# Altium schematic sheet 11_Power.SchDoc: Power (part 1 of 3)
size A3; Organization: Lime Microsystems; Address1: Surrey Tech Centre; Address2: Guildford GU2 7YG; Address3: Surrey; Address4: United Kingdom; Revision: v1.2; SheetNumber: 11; SheetTotal: 11
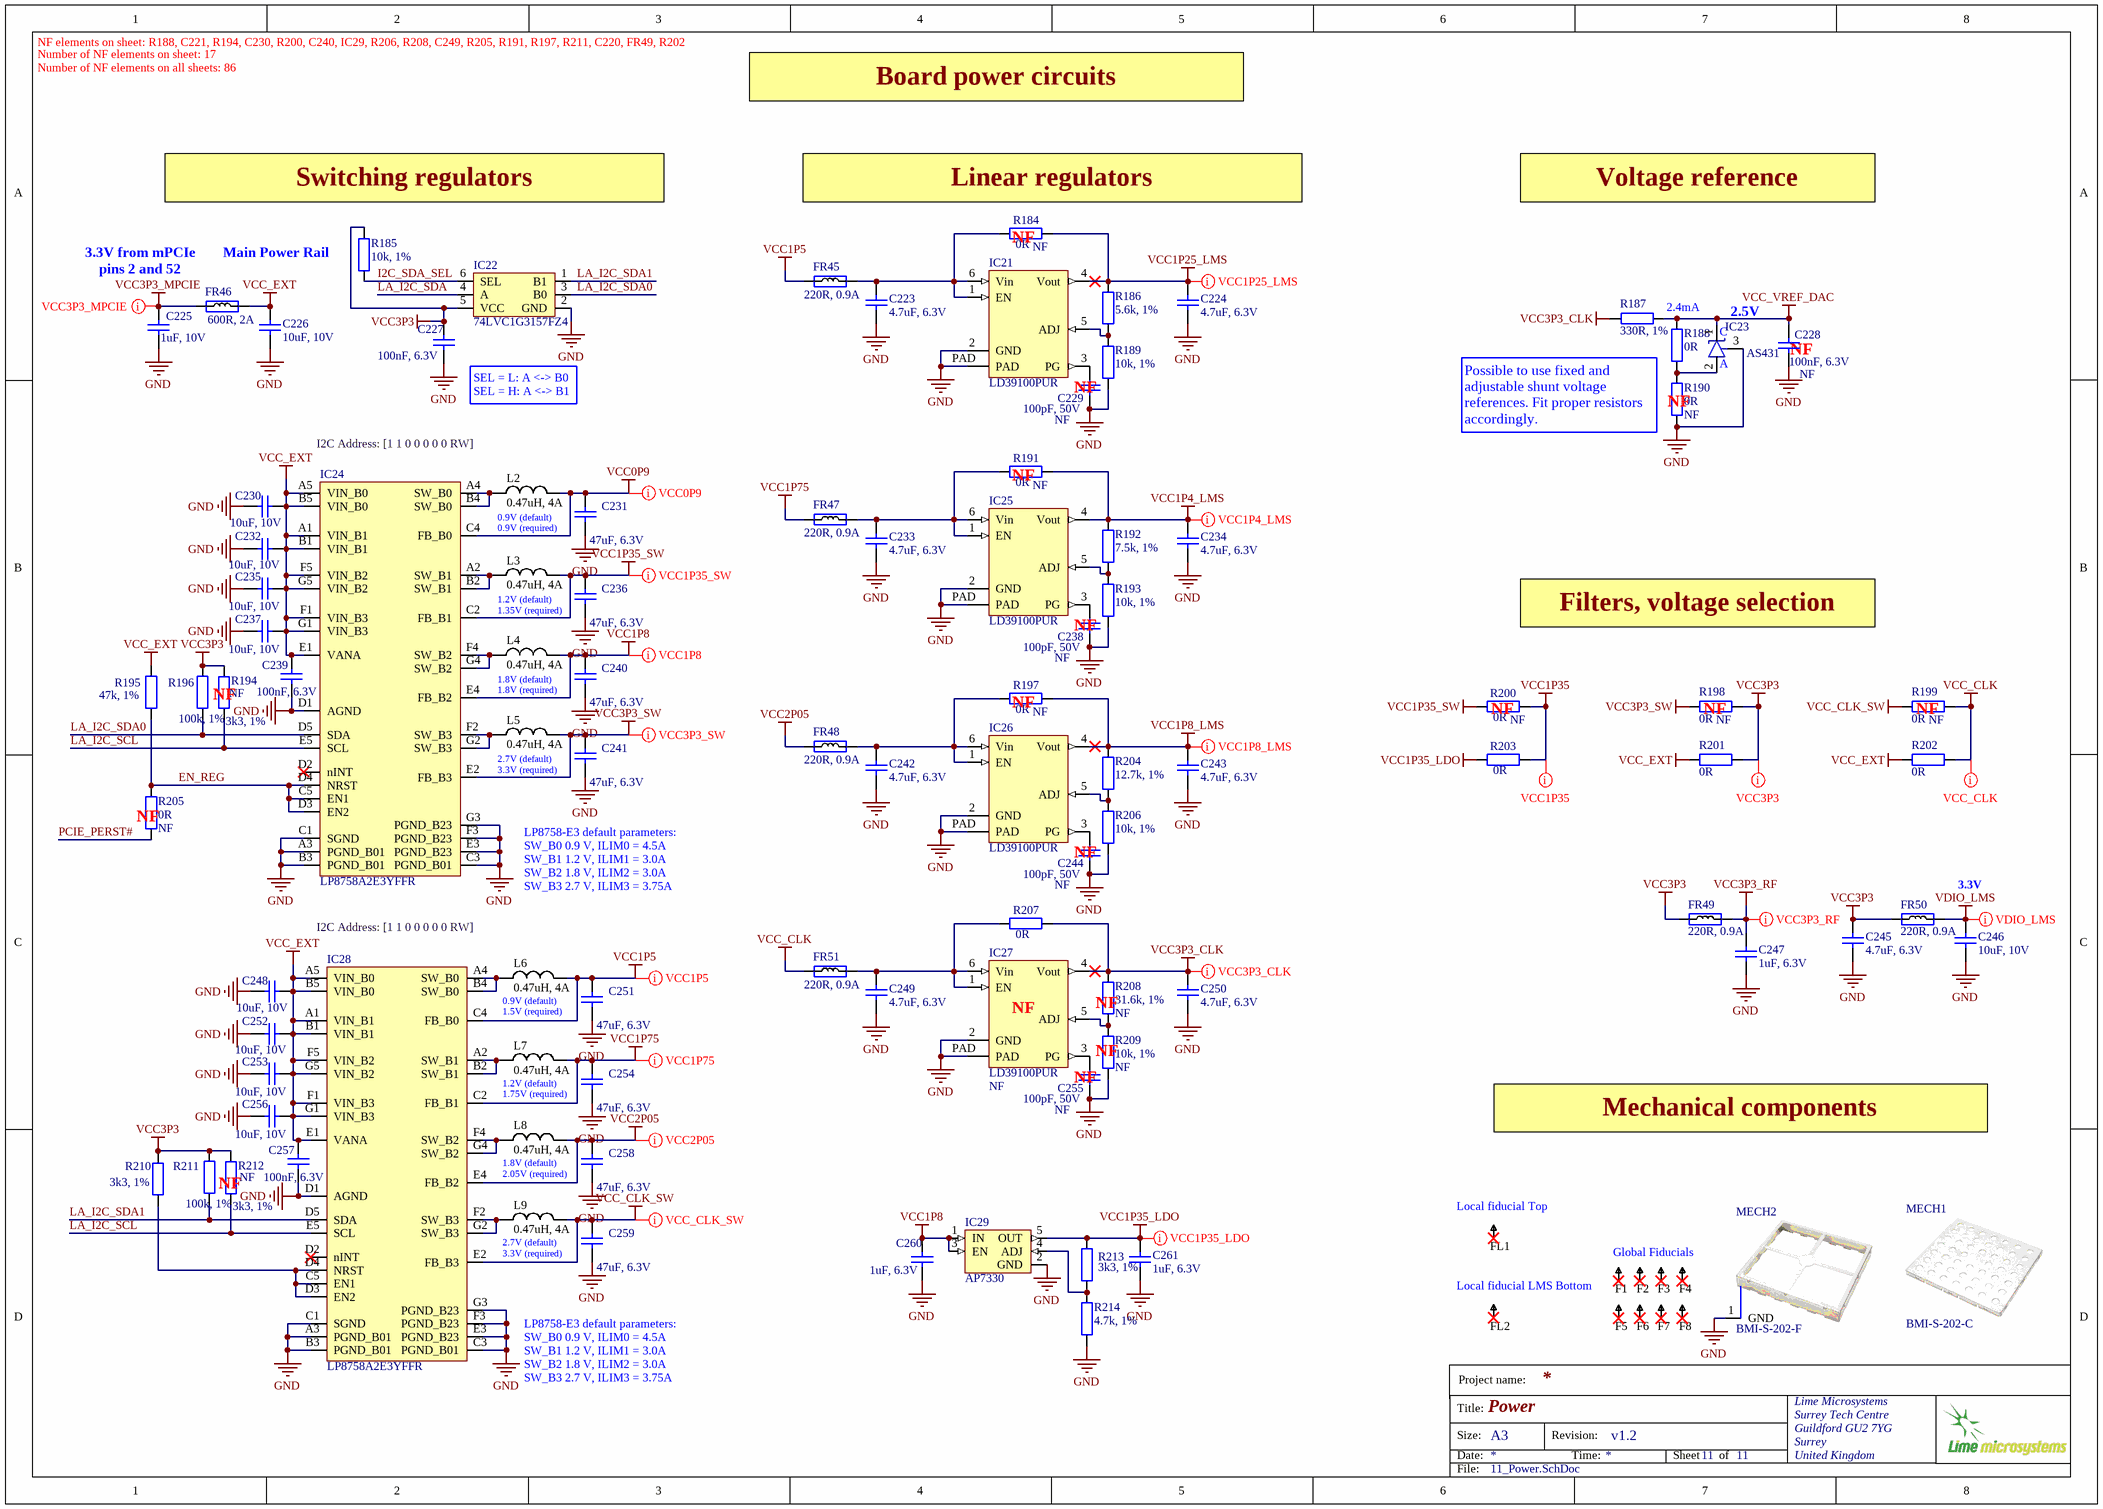
[diagram p0: 11_Power.SchDoc]

## Parts
C223  4.7uF, 6.3V  [CAP0402]
C224  4.7uF, 6.3V  [CAP0402]
C225  1uF, 10V  [CAP0402]
C226  10uF, 10V  [CAP0603]
C227  100nF, 6.3V  [CAP0201]
C228  100nF, 6.3V  Assembly Info: NF  [CAP0201]
C229  100pF, 50V  Assembly Info: NF  [CAP0201]
C230  10uF, 10V  [CAP0603]
C231  47uF, 6.3V  [CAP0603]
C232  10uF, 10V  [CAP0603]
C233  4.7uF, 6.3V  [CAP0402]
C234  4.7uF, 6.3V  [CAP0402]
C235  10uF, 10V  [CAP0603]
C236  47uF, 6.3V  [CAP0603]
C237  10uF, 10V  [CAP0603]
C238  100pF, 50V  Assembly Info: NF  [CAP0201]
C239  100nF, 6.3V  [CAP0201]
C240  47uF, 6.3V  [CAP0603]
C241  47uF, 6.3V  [CAP0603]
C242  4.7uF, 6.3V  [CAP0402]
C243  4.7uF, 6.3V  [CAP0402]
C244  100pF, 50V  Assembly Info: NF  [CAP0201]
C245  4.7uF, 6.3V  [CAP0402]
C246  10uF, 10V  [CAP0603]
C247  1uF, 6.3V  [CAP0201]
C248  10uF, 10V  [CAP0603]
C249  4.7uF, 6.3V  [CAP0402]
C250  4.7uF, 6.3V  [CAP0402]
C251  47uF, 6.3V  [CAP0603]
C252  10uF, 10V  [CAP0603]
C253  10uF, 10V  [CAP0603]
C254  47uF, 6.3V  [CAP0603]
C255  100pF, 50V  Assembly Info: NF  [CAP0201]
C256  10uF, 10V  [CAP0603]
C257  100nF, 6.3V  [CAP0201]
C258  47uF, 6.3V  [CAP0603]
C259  47uF, 6.3V  [CAP0603]
C260  1uF, 6.3V  [CAP0201]
C261  1uF, 6.3V  [CAP0201]
F1  Fiducial  [Fiducial]  (value not drawn)
F2  Fiducial  [Fiducial]  (value not drawn)
F3  Fiducial  [Fiducial]  (value not drawn)
F4  Fiducial  [Fiducial]  (value not drawn)
F5  Fiducial  [Fiducial]  (value not drawn)
F6  Fiducial  [Fiducial]  (value not drawn)
F7  Fiducial  [Fiducial]  (value not drawn)
F8  Fiducial  [Fiducial]  (value not drawn)
FL1  Fiducial  [Fiducial_local]  (value not drawn)
FL2  Fiducial  [Fiducial_local]  (value not drawn)
FR45  220R, 0.9A  [RES0402]
FR46  600R, 2A  [RES0805]
FR47  220R, 0.9A  [RES0402]
FR48  220R, 0.9A  [RES0402]
FR49  220R, 0.9A  [RES0402]
FR50  220R, 0.9A  [RES0402]
FR51  220R, 0.9A  [RES0402]
IC21  LD39100PUR  [LD39100PUR]
IC22  74LVC1G3157FZ4  [74LVC1G3157FZ4_SPDT_SW_DFN1410-6]
IC23  AS431  [SOT23-3_v3]
IC24  LP8758A2E3YFFR  [LP8758A1E0YFFR_QUAD_DC-DC_35DSBGA]
IC25  LD39100PUR  [LD39100PUR]
IC26  LD39100PUR  [LD39100PUR]
IC27  LD39100PUR  Assembly Info: NF  [LD39100PUR]
IC28  LP8758A2E3YFFR  [LP8758A1E0YFFR_QUAD_DC-DC_35DSBGA]
IC29  AP7330  [AP7330-W5-7_SOT25]
L2  0.47uH, 4A  [IND0806]
L3  0.47uH, 4A  [IND0806]
L4  0.47uH, 4A  [IND0806]
L5  0.47uH, 4A  [IND0806]
L6  0.47uH, 4A  [IND0806]
L7  0.47uH, 4A  [IND0806]
L8  0.47uH, 4A  [IND0806]
L9  0.47uH, 4A  [IND0806]
MECH1  BMI-S-202-C  [BMI-S-202-C_RF_SHIELD_COVER]
MECH2  BMI-S-202-F  [BMI-S-202-F_RF_SHIELD_FRAME_v3]
R184  0R  Assembly Info: NF  [RES0201]
R185  10k, 1%  [RES0201]
R186  5.6k, 1%  [RES0201]
R187  330R, 1%  [RES0201]
R188  0R  [RES0201]
R189  10k, 1%  [RES0201]
R190  0R  Assembly Info: NF  [RES0201]
R191  0R  Assembly Info: NF  [RES0201]
R192  7.5k, 1%  [RES0201]
R193  10k, 1%  [RES0201]
R194  3k3, 1%  Assembly Info: NF  [RES0201]
R195  47k, 1%  [RES0201]
R196  100k, 1%  [RES0201]
R197  0R  Assembly Info: NF  [RES0201]
R198  0R  Assembly Info: NF  [RES0402]
R199  0R  Assembly Info: NF  [RES0402]
R200  0R  Assembly Info: NF  [RES0201]
R201  0R  [RES0402]
R202  0R  [RES0402]
R203  0R  [RES0201]
R204  12.7k, 1%  [RES0201]
R205  0R  Assembly Info: NF  [RES0201]
R206  10k, 1%  [RES0201]
R207  0R  [RES0201]
R208  31.6k, 1%  Assembly Info: NF  [RES0201]
R209  10k, 1%  Assembly Info: NF  [RES0201]
R210  3k3, 1%  [RES0201]
R211  100k, 1%  [RES0201]
R212  3k3, 1%  Assembly Info: NF  [RES0201]
R213  3k3, 1%  [RES0201]
R214  4.7k, 1%  [RES0201]

## Nets
GND: C223.1 C224.1 C225.1 C226.1 C227.2 C228.2 C229.1 C230.1 C231.1 C232.1 C233.1 C234.1 C235.1 C236.1 C237.1 C238.1 C239.2 C240.1 C241.1 C242.1 C243.1 C244.1 C245.1 C246.1 C247.2 C248.1 C249.1 C250.1 C251.1 C252.1 C253.1 C254.1 C255.1 C256.1 C257.2 C258.1 C259.1 C260.2 C261.2 IC21.2(GND) IC21.PAD IC22.2(GND) IC23.3(NC/A) IC24.A3(PGND_B01) IC24.B3(PGND_B01) IC24.C1(SGND) IC24.C3(PGND_B01) IC24.D1(AGND) IC24.E3(PGND_B23) IC24.F3(PGND_B23) IC24.G3(PGND_B23) IC25.2(GND) IC25.PAD IC26.2(GND) IC26.PAD IC27.2(GND) IC27.PAD IC28.A3(PGND_B01) IC28.B3(PGND_B01) IC28.C1(SGND) IC28.C3(PGND_B01) IC28.D1(AGND) IC28.E3(PGND_B23) IC28.F3(PGND_B23) IC28.G3(PGND_B23) IC29.2(GND) MECH2.1(GND) R189.2 R190.2 R193.2 R206.2 R209.2 R214.2
VCC0P9: C231.2 IC24.C4(FB_B0) L2.2
VCC1P4_LMS: C234.2 IC25.4(Vout) R191.2 R192.1
VCC1P5: C251.2 FR45.1 IC28.C4(FB_B0) L6.2
VCC1P8: C240.2 C260.1 IC24.E4(FB_B2) IC29.1(IN) IC29.3(EN) L4.2
VCC1P8_LMS: C243.2 IC26.4(Vout) R197.2 R204.1
VCC1P25_LMS: C224.2 IC21.4(Vout) R184.2 R186.1
VCC1P35: R200.2 R203.2
VCC1P35_LDO: C261.1 IC29.5(OUT) R203.1 R213.1
VCC1P35_SW: C236.2 IC24.C2(FB_B1) L3.2 R200.1
VCC1P75: C254.2 FR47.1 IC28.C2(FB_B1) L7.2
VCC2P05: C258.2 FR48.1 IC28.E4(FB_B2) L8.2
VCC3P3: C227.1 C245.2 FR49.1 FR50.1 IC22.5(VCC) R185.2 R194.1 R196.1 R198.2 R201.2 R210.1 R211.1 R212.1
VCC3P3_CLK: C250.2 IC27.4(Vout) R187.2 R207.2 R208.1
VCC3P3_MPCIE: C225.2 FR46.1
VCC3P3_RF: C247.1 FR49.2
VCC3P3_SW: C241.2 IC24.E2(FB_B3) L5.2 R198.1
VCC_CLK: FR51.1 R199.2 R202.2
VCC_CLK_SW: C259.2 IC28.E2(FB_B3) L9.2 R199.1
VCC_EXT: C226.2 C230.2 C232.2 C235.2 C237.2 C239.1 C248.2 C252.2 C253.2 C256.2 C257.1 FR46.2 IC24.A1(VIN_B1) IC24.A5(VIN_B0) IC24.B1(VIN_B1) IC24.B5(VIN_B0) IC24.E1(VANA) IC24.F1(VIN_B3) IC24.F5(VIN_B2) IC24.G1(VIN_B3) IC24.G5(VIN_B2) IC28.A1(VIN_B1) IC28.A5(VIN_B0) IC28.B1(VIN_B1) IC28.B5(VIN_B0) IC28.E1(VANA) IC28.F1(VIN_B3) IC28.F5(VIN_B2) IC28.G1(VIN_B3) IC28.G5(VIN_B2) R195.1 R201.1 R202.1
VCC_VREF_DAC: C228.1 IC23.1(K) R187.1 R188.1
VDIO_LMS: C246.2 FR50.2
EN_REG: IC24.C5(EN1) IC24.D3(EN2) IC24.D4(NRST) R195.2 R205.2
I2C_SDA_SEL: IC22.6(SEL) R185.1
LA_I2C_SCL: IC24.E5(SCL) IC28.E5(SCL) R194.2 R212.2
LA_I2C_SDA: IC22.4(A)
LA_I2C_SDA0: IC22.3(B0) IC24.D5(SDA) R196.2
LA_I2C_SDA1: IC22.1(B1) IC28.D5(SDA) R211.2
PCIE_PERST#: R205.1
NetC223_2: C223.2 FR45.2 IC21.1(EN) IC21.6(Vin) R184.1
NetC229_2: C229.2 IC21.3(PG)
NetC233_2: C233.2 FR47.2 IC25.1(EN) IC25.6(Vin) R191.1
NetC238_2: C238.2 IC25.3(PG)
NetC242_2: C242.2 FR48.2 IC26.1(EN) IC26.6(Vin) R197.1
NetC244_2: C244.2 IC26.3(PG)
NetC249_2: C249.2 FR51.2 IC27.1(EN) IC27.6(Vin) R207.1
NetC255_2: C255.2 IC27.3(PG)
NetIC21_5: IC21.5(ADJ) R186.2 R189.1
NetIC23_2: IC23.2(A) R188.2 R190.1
NetIC24_A2: IC24.A2(SW_B1) IC24.B2(SW_B1) L3.1
NetIC24_A4: IC24.A4(SW_B0) IC24.B4(SW_B0) L2.1
NetIC24_F2: IC24.F2(SW_B3) IC24.G2(SW_B3) L5.1
NetIC24_F4: IC24.F4(SW_B2) IC24.G4(SW_B2) L4.1
NetIC25_5: IC25.5(ADJ) R192.2 R193.1
NetIC26_5: IC26.5(ADJ) R204.2 R206.1
NetIC27_5: IC27.5(ADJ) R208.2 R209.1
NetIC28_A2: IC28.A2(SW_B1) IC28.B2(SW_B1) L7.1
NetIC28_A4: IC28.A4(SW_B0) IC28.B4(SW_B0) L6.1
NetIC28_C5: IC28.C5(EN1) IC28.D3(EN2) IC28.D4(NRST) R210.2
NetIC28_F2: IC28.F2(SW_B3) IC28.G2(SW_B3) L9.1
NetIC28_F4: IC28.F4(SW_B2) IC28.G4(SW_B2) L8.1
NetIC29_4: IC29.4(ADJ) R213.2 R214.1

Not connected (* = marked no-connect by the designer): F1 1*; F2 1*; F3 1*; F4 1*; F5 1*; F6 1*; F7 1*; F8 1*; FL1 1*; FL2 1*; IC24 D2(nINT)*; IC28 D2(nINT)*

## Layout directives
net class VCC1P25_LMS: VCC1P25_LMS
net class VCC1P4_LMS: VCC1P4_LMS
net class VCC1P8_LMS: VCC1P8_LMS
net class VCC3P3_CLK: VCC3P3_CLK
net class VCC1P5: VCC1P5
net class VCC0P9: VCC0P9
net class VCC3P3_MPCIE: VCC3P3_MPCIE
net class VCC1P35_SW: VCC1P35_SW
net class VCC1P8: VCC1P8
net class VCC1P75: VCC1P75
net class VCC2P5: VCC2P05
net class VCC1P35_LDO: VCC1P35_LDO
net class VCC3P3_SW: VCC3P3_SW
net class VCC_CLK_SW: VCC_CLK_SW
net class VDIO_LMS: VDIO_LMS
net class VCC3P3_RF: VCC3P3_RF
net class VCC_CLK: VCC_CLK
net class VCC3P3: VCC3P3
net class VCC1P35: VCC1P35

## Notes on the sheet
- NF elements on sheet: R188, C221, R194, C230, R200, C240, IC29, R206, R208, C249, R205, R191, R197, R211, C220, FR49, R202
- Number of NF elements on sheet: 17
- Number of NF elements on all sheets: 86
- Board power circuits
- (near R185) Switching regulators
- (near R184) Linear regulators
- (near R184) NF
- Voltage reference
- (near FR46) 3.3V from mPCIe pins 2 and 52
- Main Power Rail
- 2.4mA
- 2.5V
- (near IC23) A
- (near IC23) C
- (near C228) NF
- I2C Address: [1 1 0 0 0 0 0 RW]
- (near C227) SEL = L: A <-> B0
  SEL = H: A <-> B1
- NF
- Possible to use fixed and adjustable shunt voltage references. Fit proper resistors accordingly.
- (near R190) NF
- (near R191) NF
- 0.9V (default)
  0.9V (required)
- 1.2V (default)
  1.35V (required)
- Filters, voltage selection
- (near R194) NF
- 1.8V (default)
  1.8V (required)
- (near R197) NF
- (near R200) NF
- (near R198) NF
- (near R199) NF
- 2.7V (default)
  3.3V (required)
- (near R205) NF
- LP8758-E3 default parameters:
  SW_B0 0.9 V, ILIM0 = 4.5A
  SW_B1 1.2 V, ILIM1 = 3.0A
  SW_B2 1.8 V, ILIM2 = 3.0A
  SW_B3 2.7 V, ILIM3 = 3.75A
- 3.3V
- 0.9V (default)
  1.5V (required)
- (near IC27) NF
- (near R209) NF
- (near R208) NF
- 1.2V (default)
  1.75V (required)
- Mechanical components
- 1.8V (default)
  2.05V (required)
- (near FL1) Local fiducial Top
- Global Fiducials
- Local fiducial LMS Bottom
- Project name:
- Title:
- Size:
- Date:
- A3
- Revision:
- Time:
- Sheet
- of
- File: